# EAGLE design OmegaSumo (EAGLE 9.6.2)
DOC_NUM: V1
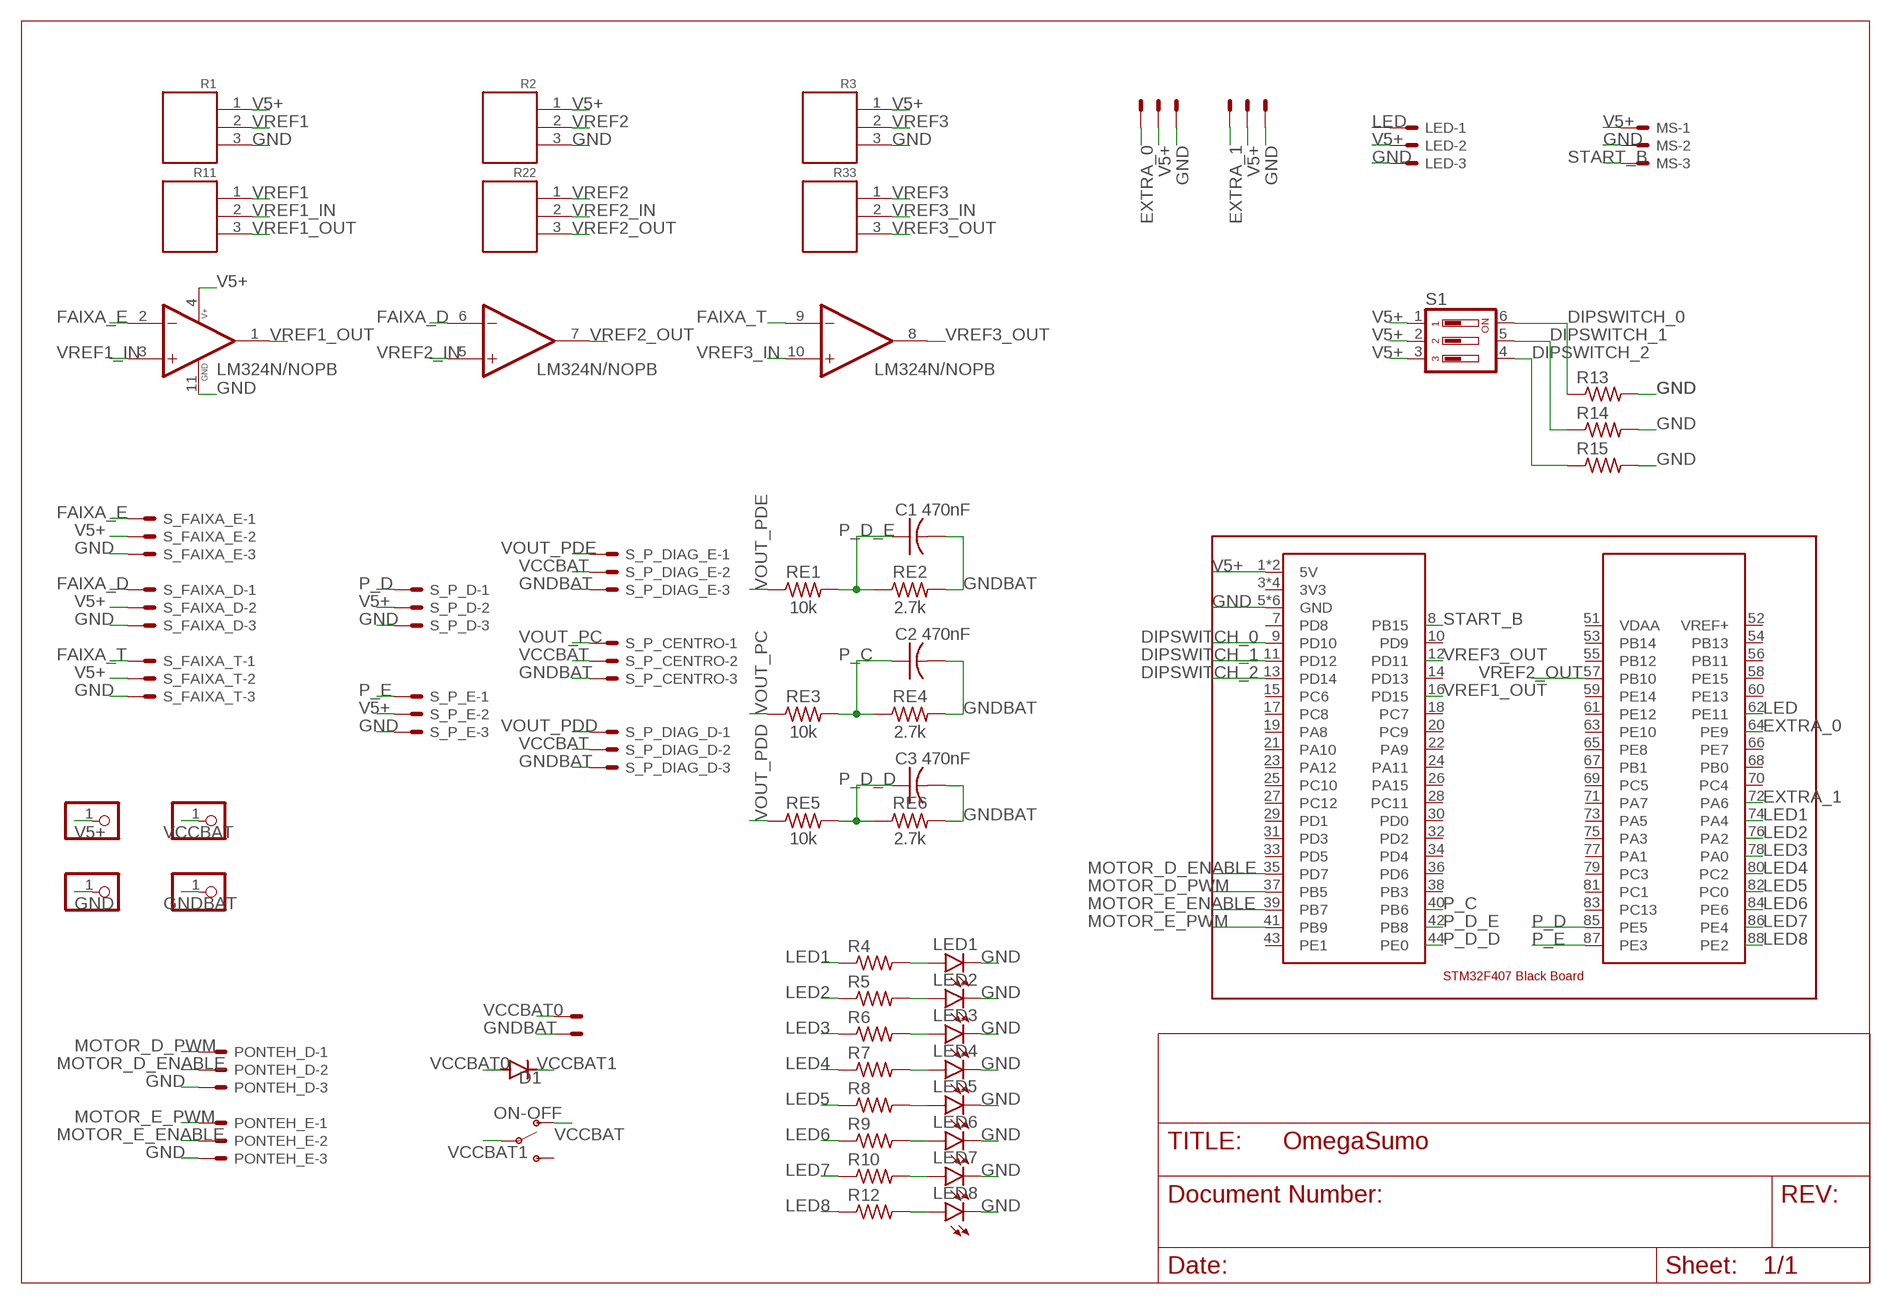
[diagram p0: schematic, sheet 1]

## Parts
5V  PINHD-1X1  [1X01]
BAT  22-23-2021  [22-23-2021]
C1  470nF  C-US050-025X075  [C050-025X075]
C2  470nF  C-US050-025X075  [C050-025X075]
C3  470nF  C-US050-025X075  [C050-025X075]
D1  1N4148DO35-7  [DO35-7]
EXTRA  22-23-2031  [22-23-2031]
EXTRA1  22-23-2031  [22-23-2031]
GNDBAT  PINHD-1X1  [1X01]
GNDOUT  PINHD-1X1  [1X01]
LED  22-23-2031  [22-23-2031]
LED1  LED3MM  [LED3MM]
LED2  LED3MM  [LED3MM]
LED3  LED3MM  [LED3MM]
LED4  LED3MM  [LED3MM]
LED5  LED3MM  [LED3MM]
LED6  LED3MM  [LED3MM]
LED7  LED3MM  [LED3MM]
LED8  LED3MM  [LED3MM]
MS  22-23-2031  [22-23-2031]
ON-OFF  SWITCH-SPDT-PTH-8.6X4.3MM-LOCK  [SWITCH_SPDT_8.6X4.3MM_LOCK]
PONTEH_D  22-23-2031  [22-23-2031]
PONTEH_E  22-23-2031  [22-23-2031]
R1  RM065  [RM065]
R2  RM065  [RM065]
R3  RM065  [RM065]
R4  R-US_0204/7  [0204/7]
R5  R-US_0204/7  [0204/7]
R6  R-US_0204/7  [0204/7]
R7  R-US_0204/7  [0204/7]
R8  R-US_0204/7  [0204/7]
R9  R-US_0204/7  [0204/7]
R10  R-US_0204/7  [0204/7]
R11  RM065  [RM065]
R12  R-US_0204/7  [0204/7]
R13  R-US_0204/7  [0204/7]
R14  R-US_0204/7  [0204/7]
R15  R-US_0204/7  [0204/7]
R22  RM065  [RM065]
R33  RM065  [RM065]
RE1  10k  R-US_0204/7  [0204/7]
RE2  2.7k  R-US_0204/7  [0204/7]
RE3  10k  R-US_0204/7  [0204/7]
RE4  2.7k  R-US_0204/7  [0204/7]
RE5  10k  R-US_0204/7  [0204/7]
RE6  2.7k  R-US_0204/7  [0204/7]
S1  DIP03YL  [DIP03YL]
S_FAIXA_D  22-23-2031  [22-23-2031]
S_FAIXA_E  22-23-2031  [22-23-2031]
S_FAIXA_T  22-23-2031  [22-23-2031]
S_P_CENTRO  22-23-2031  [22-23-2031]
S_P_D  22-23-2031  [22-23-2031]
S_P_DIAG_D  22-23-2031  [22-23-2031]
S_P_DIAG_E  22-23-2031  [22-23-2031]
S_P_E  22-23-2031  [22-23-2031]
U$5  LM324N/NOPB  [DIP825W47P254L1917H533Q14]
U$6  LIB1BLACK_BOARD  [STM32F407]
VCCBAT  PINHD-1X1  [1X01]

## Nets
DIPSWITCH_0: R13.1 S1.6 U$6.9(PD10)
DIPSWITCH_1: R14.1 S1.5 U$6.11(PD12)
DIPSWITCH_2: R15.1 S1.4 U$6.13(PD14)
EXTRA_0: EXTRA.1 U$6.64(PE9)
EXTRA_1: EXTRA1.1 U$6.72(PA6)
FAIXA_D: S_FAIXA_D.1 U$5.6(2IN-)
FAIXA_E: S_FAIXA_E.1 U$5.2(1IN-)
FAIXA_T: S_FAIXA_T.1 U$5.9(3IN-)
GND: EXTRA1.3 EXTRA.3 GNDOUT.1 LED1.K(C) LED2.K(C) LED3.K(C) LED4.K(C) LED5.K(C) LED6.K(C) LED7.K(C) LED8.K(C) LED.3 MS.2 PONTEH_D.3 PONTEH_E.3 R1.3 R2.3 R3.3 R13.2 R14.2 R15.2 S_FAIXA_D.3 S_FAIXA_E.3 S_FAIXA_T.3 S_P_D.3 S_P_E.3 U$5.11(GND) U$6.5(GND) U$6.6(GND) U$6.47(GND) U$6.48(GND) U$6.49(GND) U$6.50(GND)
GNDBAT: BAT.2 C1.2 C2.2 C3.2 GNDBAT.1 RE2.2 RE4.2 RE6.2 S_P_CENTRO.3 S_P_DIAG_D.3 S_P_DIAG_E.3
LED: LED.1 U$6.62(PE11)
LED1: R4.1 U$6.74(PA4)
LED2: R5.1 U$6.76(PA2)
LED3: R6.1 U$6.78(PA0)
LED4: R7.1 U$6.80(PC2)
LED5: R8.1 U$6.82(PC0)
LED6: R9.1 U$6.84(PE6)
LED7: R10.1 U$6.86(PE4)
LED8: R12.1 U$6.88(PE2)
MOTOR_D_ENABLE: PONTEH_D.2 U$6.35(PD7)
MOTOR_D_PWM: PONTEH_D.1 U$6.37(PB5)
MOTOR_E_ENABLE: PONTEH_E.2 U$6.39(PB7)
MOTOR_E_PWM: PONTEH_E.1 U$6.41(PB9)
N$1: LED1.A R4.2
N$2: LED2.A R5.2
N$3: LED3.A R6.2
N$4: LED4.A R7.2
N$5: LED5.A R8.2
N$6: LED6.A R9.2
N$7: LED7.A R10.2
N$8: LED8.A R12.2
P_C: C2.1 RE3.2 RE4.1 U$6.40(PB6)
P_D: S_P_D.1 U$6.85(PE5)
P_D_D: C3.1 RE5.2 RE6.1 U$6.44(PE0)
P_D_E: C1.1 RE1.2 RE2.1 U$6.42(PB8)
P_E: S_P_E.1 U$6.87(PE3)
START_B: MS.3 U$6.8(PB15)
V5+: 5V.1 EXTRA1.2 EXTRA.2 LED.2 MS.1 R1.1 R2.1 R3.1 S1.1 S1.2 S1.3 S_FAIXA_D.2 S_FAIXA_E.2 S_FAIXA_T.2 S_P_D.2 S_P_E.2 U$5.4(V+) U$6.1(5V) U$6.2(5V)
VCCBAT: ON-OFF.1(O) S_P_CENTRO.2 S_P_DIAG_D.2 S_P_DIAG_E.2 VCCBAT.1
VCCBAT0: BAT.1 D1.A
VCCBAT1: D1.C ON-OFF.2(P)
VOUT_PC: RE3.1 S_P_CENTRO.1
VOUT_PDD: RE5.1 S_P_DIAG_D.1
VOUT_PDE: RE1.1 S_P_DIAG_E.1
VREF1: R1.2 R11.1
VREF1_IN: R11.2 U$5.3(1IN+)
VREF1_OUT: R11.3 U$5.1(1OUT) U$6.16(PD15)
VREF2: R2.2 R22.1
VREF2_IN: R22.2 U$5.5(2IN+)
VREF2_OUT: R22.3 U$5.7(2OUT) U$6.57(PB10)
VREF3: R3.2 R33.1
VREF3_IN: R33.2 U$5.10(3IN+)
VREF3_OUT: R33.3 U$5.8(3OUT) U$6.12(PD11)
Unconnected: ON-OFF.3(S) U$5.12(4IN+) U$5.13(4IN-) U$5.14(4OUT) U$6.3(3V3) U$6.4(3V3) U$6.7(PD8) U$6.10(PD9) U$6.14(PD13) U$6.15(PC6) U$6.17(PC8) U$6.18(PC7) U$6.19(PA8) U$6.20(PC9) U$6.21(PA10) U$6.22(PA9) U$6.23(PA12) U$6.24(PA11) U$6.25(PC10) U$6.26(PA15) U$6.27(PC12) U$6.28(PC11) U$6.29(PD1) U$6.30(PD0) U$6.31(PD3) U$6.32(PD2) U$6.33(PD5) U$6.34(PD4) U$6.36(PD6) U$6.38(PB3) U$6.43(PE1) U$6.45(3V3) U$6.46(3V3) U$6.51(VDAA) U$6.52(VREF+) U$6.53(PB14) U$6.54(PB13) U$6.55(PB12) U$6.56(PB11) U$6.58(PE15) U$6.59(PE14) U$6.60(PE13) U$6.61(PE12) U$6.63(PE10) U$6.65(PE8) U$6.66(PE7) U$6.67(PB1) U$6.68(PB0) U$6.69(PC5) U$6.70(PC4) U$6.71(PA7) U$6.73(PA5) U$6.75(PA3) U$6.77(PA1) U$6.79(PC3) U$6.81(PC1) U$6.83(PC13)

## Library data of the parts
5V GNDBAT GNDOUT VCCBAT = pinhead:PINHD-1X1: PIN HEADER
BAT = con-molex:22-23-2021: .100" (2.54mm) Center Header - 2 Pin; MF: MOLEX; MPN: 22-23-2021; OC_FARNELL: 1462926; OC_NEWARK: 25C3832
C1-C3 = rcl:C-US: CAPACITOR, American symbol; SPICEPREFIX: C
D1 = diode:1N4148: DIODE high speed (Philips)
EXTRA EXTRA1 LED MS PONTEH_D PONTEH_E S_FAIXA_D S_FAIXA_E S_FAIXA_T S_P_CENTRO S_P_D S_P_DIAG_D S_P_DIAG_E S_P_E = con-molex:22-23-2031: .100" (2.54mm) Center Header - 3 Pin; MF: MOLEX; MPN: 22-23-2031; OC_FARNELL: 1462950; OC_NEWARK: 30C0862
LED1-LED8 = led:LED: LED OSRAM: - CHIPLED LG R971, LG N971, LY N971, LG Q971, LY Q971, LO R971, LY R971 LH N974, LH R974 LS Q976, LO Q976, LY Q976 LO Q996 - Hyper CHIPLED LW Q18S LB Q993, LB Q99A, LB R99A - SideLED LS A670, LO A670, LY A670, LG A670, LP A670 LB A673, LV A673, LT A673, LW A673 LH A674 LY A675 LS A676, LA A676, LO A676, LY A676, LW A676 LS A679, LY A679, LG A679 - Hyper Micro SIDELED® LS Y876, LA Y876, LO Y876, LY Y876 LT Y87S - SmartLED LW L88C, LW L88S LB L89C, LB L89S, LG L890 LS L89K, LO L89K, LY L89K LS L896, LA L896, LO L896, LY L896 - TOPLED LS T670, LO T670, LY T670, LG T670, LP T670 LSG T670, LSP T670, LSY T670, LOP T670, LYG T670 LG T671, LOG T671, LSG T671 LB T673, LV T673, LT T673, LW T673 LH T674 LS T676, LA T676, LO T676, LY T676, LB T676, LH T676, LSB T676, LW T676 LB T67C, LV T67C, LT T67C, LS T67K, LO T67K, LY T67K, LW E67C LS E67B, LA E67B, LO E67B, LY E67B, LB E67C, LV E67C, LT E67C LW T67C LS T679, LY T679, LG T679 LS T770, LO T770, LY T770, LG T770, LP T770 LB T773, LV T773, LT T773, LW T773 LH T774 LS E675, LA E675, LY E675, LS T675 LS T776, LA T776, LO T776, LY T776, LB T776 LHGB T686 LT T68C, LB T68C - Hyper Mini TOPLED® LB M676 - Mini TOPLED Santana® LG M470 LS M47K, LO M47K, LY M47K Source: http://www.osram.convergy.de LUXEON: - LUMILED® LXK2-PW12-R00, LXK2-PW12-S00, LXK2-PW14-U00, LXK2-PW14-V00 LXK2-PM12-R00, LXK2-PM12-S00, LXK2-PM14-U00 LXK2-PE12-Q00, LXK2-PE12-R00, LXK2-PE12-S00, LXK2-PE14-T00, LXK2-PE14-U00 LXK2-PB12-K00, LXK2-PB12-L00, LXK2-PB12-M00, LXK2-PB14-N00, LXK2-PB14-P00, LXK2-PB14-Q00 LXK2-PR12-L00, LXK2-PR12-M00, LXK2-PR14-Q00, LXK2-PR14-R00 LXK2-PD12-Q00, LXK2-PD12-R00, LXK2-PD12-S00 LXK2-PH12-R00, LXK2-PH12-S00 LXK2-PL12-P00, LXK2-PL12-Q00, LXK2-PL12-R00 Source: www.luxeon.com KINGBRIGHT: KA-3528ASYC Source: www.kingbright.com
ON-OFF = SparkFun-Switches:SWITCH-SPDT: Single Pole, Double Throw (SPDT) Switch Single-pole, double-throw (SPDT) switch. Variant Overview SMD-AYZ0202 Surface Mount DPDT Switch <https://www.sparkfun.com/products/597> (COM-00597) Used on e.g. LilyPad Arduino USB - ATmega32U4 Board <https://www.sparkfun.com/products/12049> PTH-11.6X4.0MM SPDT Mini Power Switch <https://www.sparkfun.com/products/102> (COM-00102) Used on e.g. SparkFun Simon Says - Through-Hole Soldering Kit <https://www.sparkfun.com/products/10547> (KIT-10547) PTH-11.6X4.0MM-KIT KIT version of SPDT Mini Power Switch - Simplifies soldering by removing tStop of switch pins - only one side can be soldered. PTH-11.6X4.0MM-LOCK LOCK version of SPDT Mini Power Switch - Offset pins hold switch in place for easier soldering. SMD-RIGHT-ANGLE Surface Mount Right Angle Switch <https://www.sparkfun.com/products/10860> (COM-10860) Used on e.g. SparkFun ESP8266 Thing <https://www.sparkfun.com/products/13231>; PROD_ID: SWCH-14746
R1-R3 R11 R22 R33 = RM065:RM065: Trimpot Varable resistor Reference: http://www.runtron.com/down/PDF%20Datasheet/Carbon%20Film%20Potentiometer/RM065%20RM063.pdf Check availability <https://pricing.snapeda.com/parts/RM-065/Vishay/view-part?ref=eda>; AVAILABILITY: Not in stock; CHECK_PRICES: https://www.snapeda.com/parts/RM-065/Vishay/view-part/?ref=eda; DESCRIPTION: Circuit Breaker Thermal 6.5A 240V AC 60V DC Rocker Panel Mount, Snap-In; MF: Vishay; MP: RM-065; PACKAGE: None; PRICE: None; SNAPEDA_LINK: https://www.snapeda.com/parts/RM-065/Vishay/view-part/?ref=snap
R4-R10 R12-R15 RE1-RE6 = rcl:R-US_: RESISTOR, American symbol; SPICEPREFIX: R
S1 = switch-dil:DIP03YL: DIL/CODE SWITCH; OC_FARNELL: unknown; OC_NEWARK: unknown
U$5 = LM324N_NOPB:LM324N/NOPB: Check availability <https://pricing.snapeda.com/parts/LM324N/Texas%20Instruments/view-part?ref=eda>; AVAILABILITY: In Stock; DESCRIPTION: Quad, 30-V, 1.2-MHz operational amplifier; MF: Texas Instruments; MP: LM324N; PACKAGE: PDIP-14 Texas Instruments; PRICE: None; PURCHASE-URL: https://pricing.snapeda.com/search?q=LM324N&ref=eda
U$6 = stm32f407:LIB1

## Board
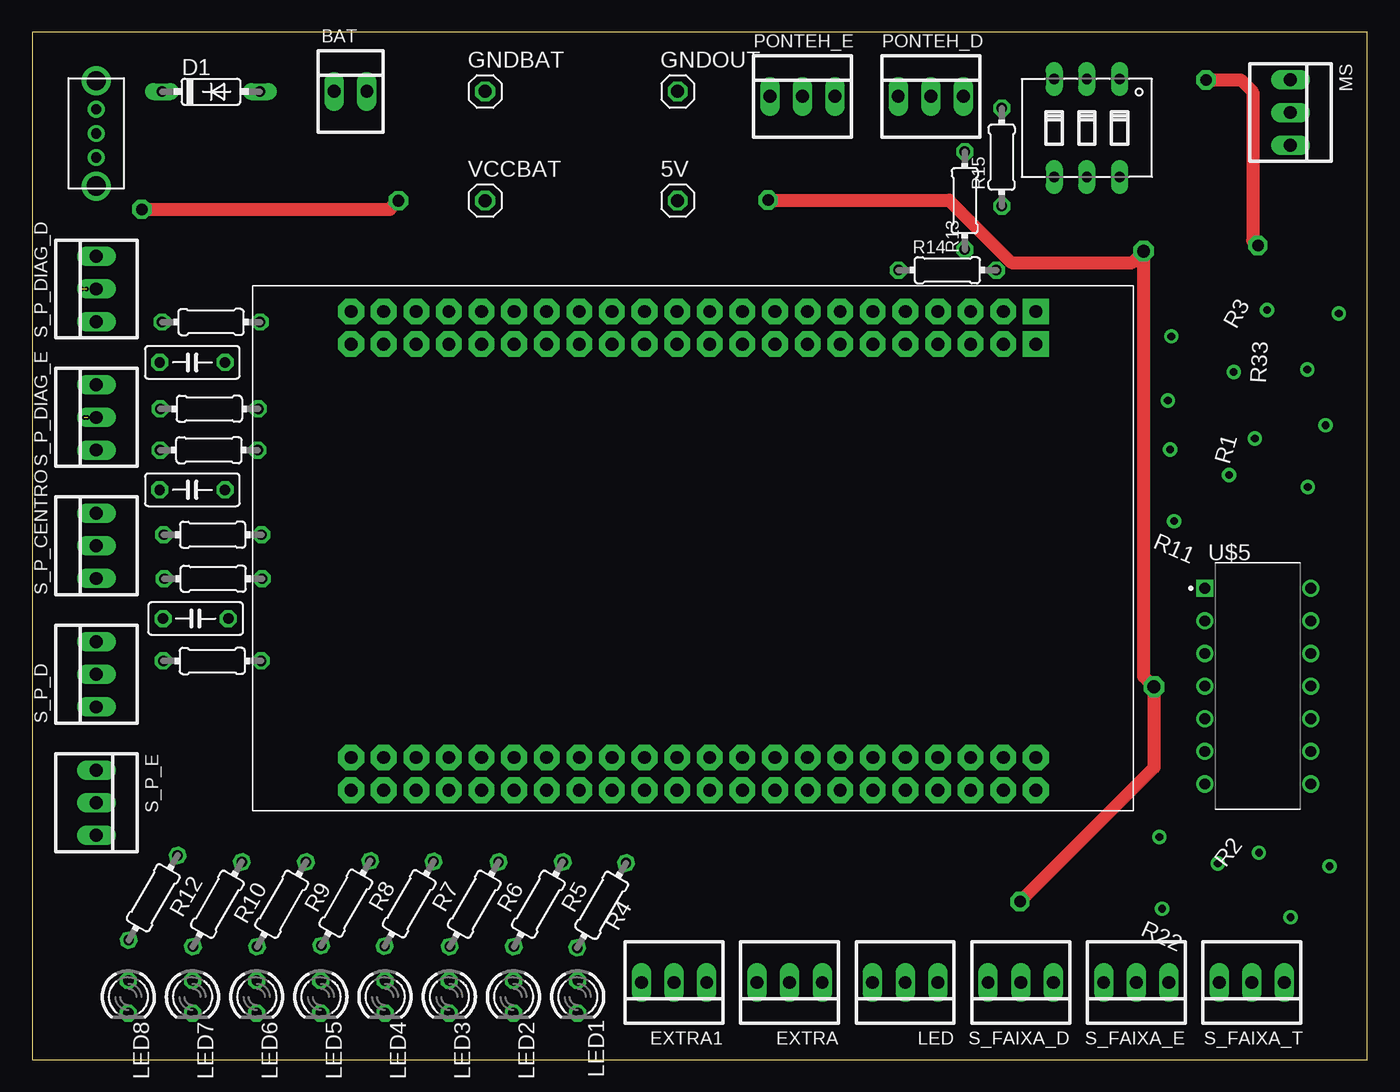
[diagram p1: board, top side]
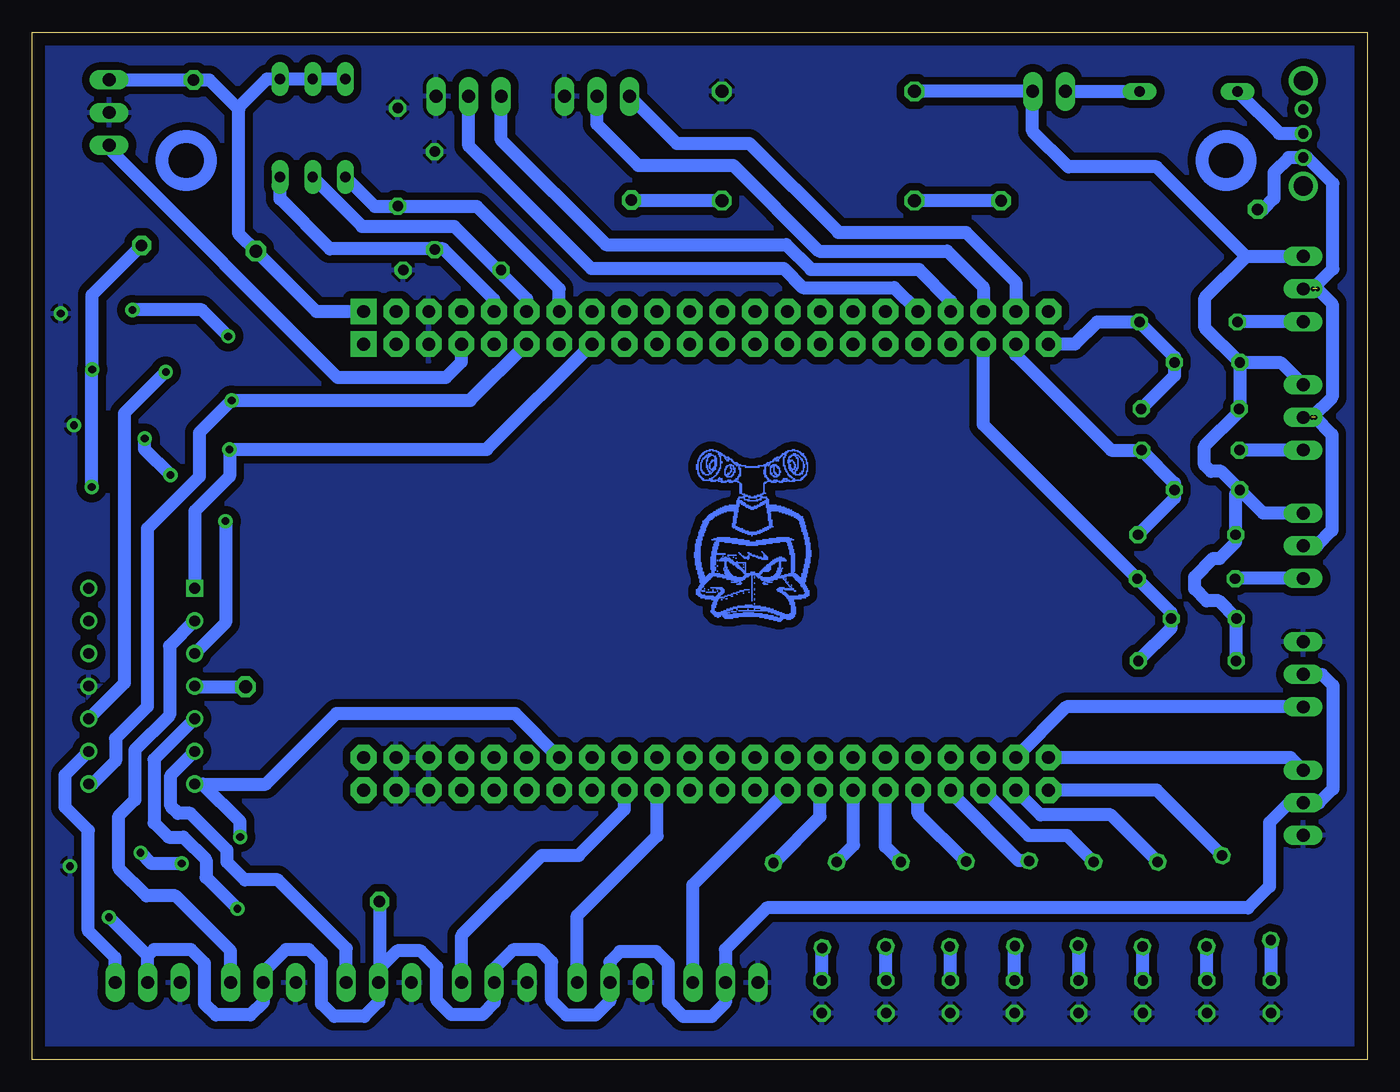
[diagram p2: board, bottom side, seen from below]

Size 104 x 80 mm. Coordinates in mm from the lower left corner, seen from the top.
Outline: 0,0 104,0 104,80 0,80 0,0
Copper layers (1*16): Top 0.035mm / dielectric 1.5mm / Bottom 0.035mm
Design rules "default": minimum track width 6mil, minimum drill 0.35mm, track to track 6mil, track to pad 6mil, pad to pad 6mil, via to via 6mil, smd to smd 6mil, copper to edge 40mil, drill to drill 6mil, minimum pad ring 10mil, minimum via ring 8mil, stop-mask expansion 4mil, vias tented up to drill 0mil, thermal gap 10mil

### Footprints (pad centres in the part's own frame; a part is rotated, then mirrored left to right if it is on the bottom)
1X01 = drill 1.016 octagon: 1 0,0
22-23-2021 = drill 1 long: 1 -1.27,0; 2 1.27,0
C050-025X075 = drill 0.813 octagon: 1 -2.54,0; 2 2.54,0
DO35-7 = drill 0.813 long: A 3.81,0; C -3.81,0
22-23-2031 = drill 1 long: 1 -2.54,0; 2 0,0; 3 2.54,0
LED3MM = drill 0.813 octagon: A -1.27,0; K 1.27,0
SWITCH_SPDT_8.6X4.3MM_LOCK = drill 0.8: 1 -1.88,0; 2 0,0; 3 1.88,0 | drill 1.5: 4 -4.1,0; 5 4.1,0
RM065 = drill 0.6: 1 -2.5,-2.5; 2 0,2.5; 3 2.5,-2.5
0204/7 = drill 0.813 octagon: 1 -3.81,0; 2 3.81,0
DIP03YL = drill 0.813 long: 1 -2.54,-3.81; 2 0,-3.81; 3 2.54,-3.81; 4 2.54,3.81; 5 0,3.81; 6 -2.54,3.81
DIP825W47P254L1917H533Q14 = drill 0.83 pad 1.18 square: 1 -4.128,7.62 | drill 0.83 pad 1.18: 2 -4.128,5.08; 3 -4.128,2.54; 4 -4.128,0; 5 -4.128,-2.54; 6 -4.128,-5.08; 7 -4.128,-7.62; 8 4.128,-7.62; 9 4.128,-5.08; 10 4.128,-2.54; 11 4.128,0; 12 4.128,2.54; 13 4.128,5.08; 14 4.128,7.62
STM32F407 = drill 1 pad 2 square: 1 2,61; 2 4.54,61 | drill 1 pad 2 octagon: 3 2,58.46; 4 4.54,58.46; 5 2,55.92; 6 4.54,55.92; 7 2,53.38; 8 4.54,53.38; 9 2,50.84; 10 4.54,50.84; 11 2,48.3; 12 4.54,48.3; 13 2,45.76; 14 4.54,45.76; 15 2,43.22; 16 4.54,43.22; 17 2,40.68; 18 4.54,40.68; 19 2,38.14; 20 4.54,38.14; 21 2,35.6; 22 4.54,35.6; 23 2,33.06; 24 4.54,33.06; 25 2,30.52; 26 4.54,30.52; 27 2,27.98; 28 4.54,27.98; 29 2,25.44; 30 4.54,25.44; 31 2,22.9; 32 4.54,22.9; 33 2,20.36; 34 4.54,20.36; 35 2,17.82; 36 4.54,17.82; 37 2,15.28; 38 4.54,15.28; 39 2,12.74; 40 4.54,12.74; 41 2,10.2; 42 4.54,10.2; 43 2,7.66; 44 4.54,7.66; 45 36.73,61; 46 39.27,61; 47 36.73,58.46; 48 39.27,58.46; 49 36.73,55.92; 50 39.27,55.92; 51 36.73,53.38; 52 39.27,53.38; 53 36.73,50.84; 54 39.27,50.84; 55 36.73,48.3; 56 39.27,48.3; 57 36.73,45.76; 58 39.27,45.76; 59 36.73,43.22; 60 39.27,43.22; 61 36.73,40.68; 62 39.27,40.68; 63 36.73,38.14; 64 39.27,38.14; 65 36.73,35.6; 66 39.27,35.6; 67 36.73,33.06; 68 39.27,33.06; 69 36.73,30.52; 70 39.27,30.52; 71 36.73,27.98; 72 39.27,27.98; 73 36.73,25.44; 74 39.27,25.44; 75 36.73,22.9; 76 39.27,22.9; 77 36.73,20.36; 78 39.27,20.36; 79 36.73,17.82; 80 39.27,17.82; 81 36.73,15.28; 82 39.27,15.28; 83 36.73,12.74; 84 39.27,12.74; 85 36.73,10.2; 86 39.27,10.2; 87 36.73,7.66; 88 39.27,7.66

### Placement (x,y rotation side)
5V  50.28,66.88 0 top
BAT  24.8,75.39 0 top
C1  12.48,44.36 180 top
C2  12.74,34.34 180 top
C3  12.48,54.28 180 top
D1  13.93,75.36 0 top
EXTRA  59,6 180 top
EXTRA1  50,6 180 top
GNDBAT  35.28,75.38 0 top
GNDOUT  50.28,75.38 0 top
LED  68,6 180 top
LED1  42.49,4.89 270 top
LED2  37.49,4.89 270 top
LED3  32.49,4.89 270 top
LED4  27.49,4.89 270 top
LED5  22.49,4.89 270 top
LED6  17.49,4.89 270 top
LED7  12.49,4.89 270 top
LED8  7.49,4.89 270 top
MS  98,73.74 270 top
ON-OFF  4.99,72.11 90 top
PONTEH_D  70,75 0 top
PONTEH_E  60,75 0 top
R1  97.64,47.67 74 top
R2  97.54,14.59 52.7 top
R3  98.37,57.14 60.6 top
R4  44.35,12.01 240 top
R5  39.43,12.09 240 top
R6  34.43,12.09 240 top
R7  29.36,12.13 240 top
R8  24.43,12.18 240 top
R9  19.43,12.09 240 top
R10  14.43,12.09 240 top
R11  89.93,44.22 156.6 top
R12  9.43,12.6 240 top
R13  72.64,66.88 90 top
R14  71.28,61.46 0 top
R15  75.52,70.27 90 top
R22  89.04,14.02 155.6 top
R33  91.09,53.68 266.9 top
RE1  13.77,47.45 0 top
RE2  14.06,40.87 180 top
RE3  14.11,37.44 0 top
RE4  14.03,31.04 180 top
RE5  13.94,57.43 0 top
RE6  13.8,50.67 180 top
S1  82.15,72.54 180 top
S_FAIXA_D  77,6 180 top
S_FAIXA_E  86,6 180 top
S_FAIXA_T  95,6 180 top
S_P_CENTRO  5,40 90 top
S_P_D  5,30 90 top
S_P_DIAG_D  5,60 90 top
S_P_DIAG_E  5,50 90 top
S_P_E  5,20 270 top
U$5  95.46,29.08 0 top
U$6  17.18,60.25 270 top
VCCBAT  35.28,66.88 0 top

### Tracks (layer width: path | path; a pad name or v marks a point on that pad's centre or on a via)
DIPSWITCH_0
  Bottom 1.016: U$6.9 68.02,59.17 71.98,63.13 72.55,63.13 | S1.6 84.69,67.01 80.81,63.13 72.55,63.13 | R13.1 72.61,63.07 72.55,63.13
DIPSWITCH_1
  Bottom 1.016: S1.5 78.3,64.88 71.13,64.88 67.47,61.22 | U$6.11 65.48,59.23 67.21,60.96 67.47,61.22 | R14.1 67.47,61.22
DIPSWITCH_2
  Bottom 1.016: U$6.13 62.94,60 69.35,66.41 75.43,66.41 75.47,66.41 | S1.4 77.29,66.41 75.47,66.41 | R15.1 75.47,66.41
EXTRA_0
  Bottom 1.016: EXTRA.1 61.54,11.21 55.32,17.43 U$6.64
EXTRA_1
  Bottom 1.016: EXTRA1.1 52.54,13.6 U$6.72
FAIXA_D
  Bottom 1.016: S_FAIXA_D.1 79.54,8.67 84.86,13.99 87.43,13.99 88.81,15.37 88.81,16.31 91.68,19.18 92.64,19.18 93.2,19.74 93.2,22.13 U$5.6
FAIXA_E
  Bottom 1.016: S_FAIXA_E.1 88.54,8.46 92.83,12.75 95.09,12.75 97.25,14.91 97.25,18.97 96,20.21 96,24.12 93.3,26.82 93.3,32.19 U$5.2
FAIXA_T
  Bottom 1.016: U$5.9 101.42,22.17 101.42,19.65 99.61,17.84 99.61,10.02 97.54,7.95 S_FAIXA_T.1
GND
  pour Bottom (isolate 0.61): 0.08,79.92 104.04,79.92 104.04,0.08 0.08,0.08
GNDBAT
  Bottom 1.016: 9.41,62.54 S_P_DIAG_D.3 | 9.41,62.54 9.47,62.54 16.43,69.5 23.28,69.5 26.07,72.3 BAT.2 GNDBAT.1 | 9.41,62.54 12.65,59.3 12.65,56.99 C3.2 9.91,54.25 | RE4.2 10.22,34.32 C2.2 11.59,35.73 12.53,35.73 13.46,36.66 13.46,37.59 12.02,39.03 11.51,39.03 10.25,40.29 RE2.2 10.25,44.05 C1.2 | S_P_CENTRO.3 8.12,42.54 C1.2 | S_P_DIAG_E.3 6.71,54.25 9.91,54.25 | C1.2 11.38,45.8 12.19,45.8 12.7,46.31 12.7,47.75 9.99,50.45 RE6.2 9.91,50.76 9.91,54.25
LED
  Bottom 1.016: LED.1 70.54,9.67 64.3,15.91 61.44,15.91 57.86,19.49 U$6.62
LED1
  Bottom 1.016: R4.1 42.62,18.95 U$6.74
LED2
  Bottom 1.016: U$6.76 40.02,20.92 40.02,16.7 R5.1
LED3
  Bottom 1.016: R6.1 37.54,16.6 U$6.78
LED4
  Bottom 1.016: R7.1 35,19.16 U$6.80
LED5
  Bottom 1.016: U$6.82 32.3,20.98 32.3,20.62 27.18,15.49 26.35,15.49 R8.1
LED6
  Bottom 1.016: R9.1 23.38,17.44 26.38,17.44 U$6.84
LED7
  Bottom 1.016: U$6.86 25.46,19.06 20,19.06 R10.1
LED8
  Bottom 1.016: R12.1 16.41,20.98 U$6.88
MOTOR_D_ENABLE
  Bottom 1.016: PONTEH_D.2 70,71.15 60.45,61.6 45.45,61.6 43.96,60.11 36.86,60.11 U$6.35
MOTOR_D_PWM
  Bottom 1.016: PONTEH_D.1 67.46,71.6 59.31,63.45 45.28,63.45 43.35,61.52 34.92,61.52 32.46,59.06 U$6.37
MOTOR_E_ENABLE
  Bottom 1.016: PONTEH_E.2 60,72.84 56.79,69.63 49.39,69.63 42.71,62.95 32.72,62.95 29.92,60.15 U$6.39
MOTOR_E_PWM
  Bottom 1.016: PONTEH_E.1 53.8,71.34 48.15,71.34 41.21,64.4 31.27,64.4 27.38,60.51 U$6.41
N$1
  Bottom 1.016: LED1.A 42.49,8.67 R4.2
N$2
  Bottom 1.016: LED2.A 37.49,8.76 R5.2
N$3
  Bottom 1.016: LED3.A 32.49,8.76 R6.2
N$4
  Bottom 1.016: LED4.A 27.49,8.8 R7.2
N$5
  Bottom 1.016: LED5.A 22.49,8.85 R8.2
N$6
  Bottom 1.016: LED6.A 17.49,8.76 R9.2
N$7
  Bottom 1.016: LED7.A 12.49,8.76 R10.2
N$8
  Bottom 1.016: LED8.A 7.49,9.27 R12.2
P_C
  Bottom 1.016: U$6.40 29.92,49.44 RE3.2 15.28,34.8 C2.1 15.28,33.6 RE4.1
P_D
  Bottom 1.016: U$6.85 23.44,27.46 S_P_D.1
P_D_D
  Bottom 1.016: U$6.44 22.78,55.7 21.05,57.43 RE5.2 15.02,54.7 C3.1 15.02,53.27 RE6.1
P_D_E
  Bottom 1.016: U$6.42 27.38,54.87 19.96,47.45 RE1.2 15.02,44.89 C1.1 15.02,43.72 RE2.1
P_E
  Bottom 1.016: S_P_E.1 5.98,23.52 U$6.87
START_B
  Bottom 1.016: U$6.8 70.56,54.32 71.79,53.09 80.19,53.09 98,70.9 MS.3
V5+  (via drill 0.9 pad 1.5, 1 pad 1.6)
  Top 1.016: v57.32,66.92 71.41,66.92 76.28,62.05 85.68,62.05 v86.56,62.94 86.56,29.84 v87.37,29.03 87.37,22.74 v76.94,12.31 | v91.43,76.28 94.14,76.28 95.07,75.35 95.07,63.79 v95.47,63.39
  Bottom 1.016: 5V.1 57.28,66.88 v57.32,66.92 | 87.99,74.07 85.71,76.35 S1.1 S1.2 S1.3 | 87.99,74.07 87.9,73.98 87.9,64.28 v86.56,62.94 81.88,58.25 U$6.1 | 87.99,74.07 90.2,76.28 v91.43,76.28 MS.1 | S_P_D.2 3.55,30 2.68,29.13 2.68,21.09 3.77,20 S_P_E.2 6.1,20 7.64,18.46 7.64,13.5 9.31,11.82 46.77,11.82 50,8.59 EXTRA1.2 50,4.43 51.08,3.35 53.29,3.35 54.44,4.5 54.44,7.47 55.37,8.4 58.21,8.4 59,7.61 EXTRA.2 59,4.58 60.12,3.46 62.38,3.46 63.53,4.61 63.53,7.6 64.47,8.54 66.55,8.54 68,7.09 LED.2 68,4.44 68.93,3.51 71.36,3.51 72.49,4.64 72.49,7.22 73.74,8.47 75.56,8.47 77,7.03 S_FAIXA_D.2 | v87.37,29.03 91.28,29.03 U$5.4 | S_FAIXA_D.2 77,4.5 78.14,3.36 80.46,3.36 81.45,4.35 81.45,7.59 82.43,8.57 84.25,8.57 86,6.82 S_FAIXA_E.2 86,4.48 87,3.48 89.67,3.48 90.56,4.37 90.56,7.51 91.62,8.57 94.52,8.57 95,8.09 | S_FAIXA_T.2 95,8.09 | 95,8.09 98,11.09 R2.1 | v76.94,12.31 76.94,6.06 S_FAIXA_D.2 | R1.1 99.35,53.7 R3.1 99.32,59.54 v95.47,63.39
VCCBAT  (via drill 0.35, 0.9 pad 1.5)  (2 unrouted)
  Top 1.016: v8.55,66.2 27.86,66.2 v28.53,66.87
  Bottom 1.016: S_P_CENTRO.2 3.91,40 3.91,40.06 2.76,41.21 2.76,48.69 v4.07,50 | VCCBAT.1 35.24,66.84 35.21,66.87 v28.53,66.87 | S_P_DIAG_D.2 v4.24,60 2.68,61.56 2.68,68.22 4.68,70.23 ON-OFF.1 6.13,70.23 7.28,69.08 7.28,67.05 8.13,66.2 v8.55,66.2 | v3.89,60 2.74,58.85 2.74,51.58 v4.32,50 S_P_DIAG_E.2
VCCBAT0
  Bottom 1.016: BAT.1 17.77,75.39 D1.A
VCCBAT1
  Bottom 1.016: D1.C 6.87,72.11 ON-OFF.2
VOUT_PC
  Bottom 1.016: S_P_CENTRO.1 10.28,37.46 RE3.1
VOUT_PDD
  Bottom 1.016: S_P_DIAG_D.1 10.1,57.46 RE5.1
VOUT_PDE
  Bottom 1.016: S_P_DIAG_E.1 RE1.1
VREF1
  Bottom 1.016: R11.1 95.24,47.54 R1.2
VREF1_IN
  Bottom 1.016: R11.2 88.94,34.02 U$5.3
VREF1_OUT
  Bottom 1.016: U$5.1 91.33,42.71 88.63,45.41 R11.3 68.6,47.51 U$6.16
VREF2
  Bottom 1.016: R22.1 94.71,15.26 R2.2
VREF2_IN
  Bottom 1.016: R22.2 90.46,14.2 90.46,15.55 92.23,17.32 93.38,17.32 94.5,18.44 94.5,23.37 U$5.5
VREF2_OUT
  Bottom 1.016: R22.3 87.8,18.55 90.71,21.46 | U$5.7 90.71,21.46 | 90.71,21.46 85.79,21.46 80.3,26.95 66.37,26.95 U$6.57
VREF3
  Bottom 1.016: R33.1 90.78,58.37 R3.2
VREF3_IN
  Bottom 1.016: R33.2 96.81,50.32 96.81,29.32 U$5.10
VREF3_OUT
  Bottom 1.016: U$5.8 99.3,21.46 97.5,23.26 97.5,25.01 95.02,27.49 95.02,41.35 90.98,45.39 90.98,48.8 R33.3 69.87,51.32 U$6.12
(copper drawn outside any net)
  shapes: Bottom area x991, Bottom circle x2